# Altium schematic sheet Sheet1.SchDoc
size 431 x 279 mm; SheetNumber: 1; SheetTotal: 1
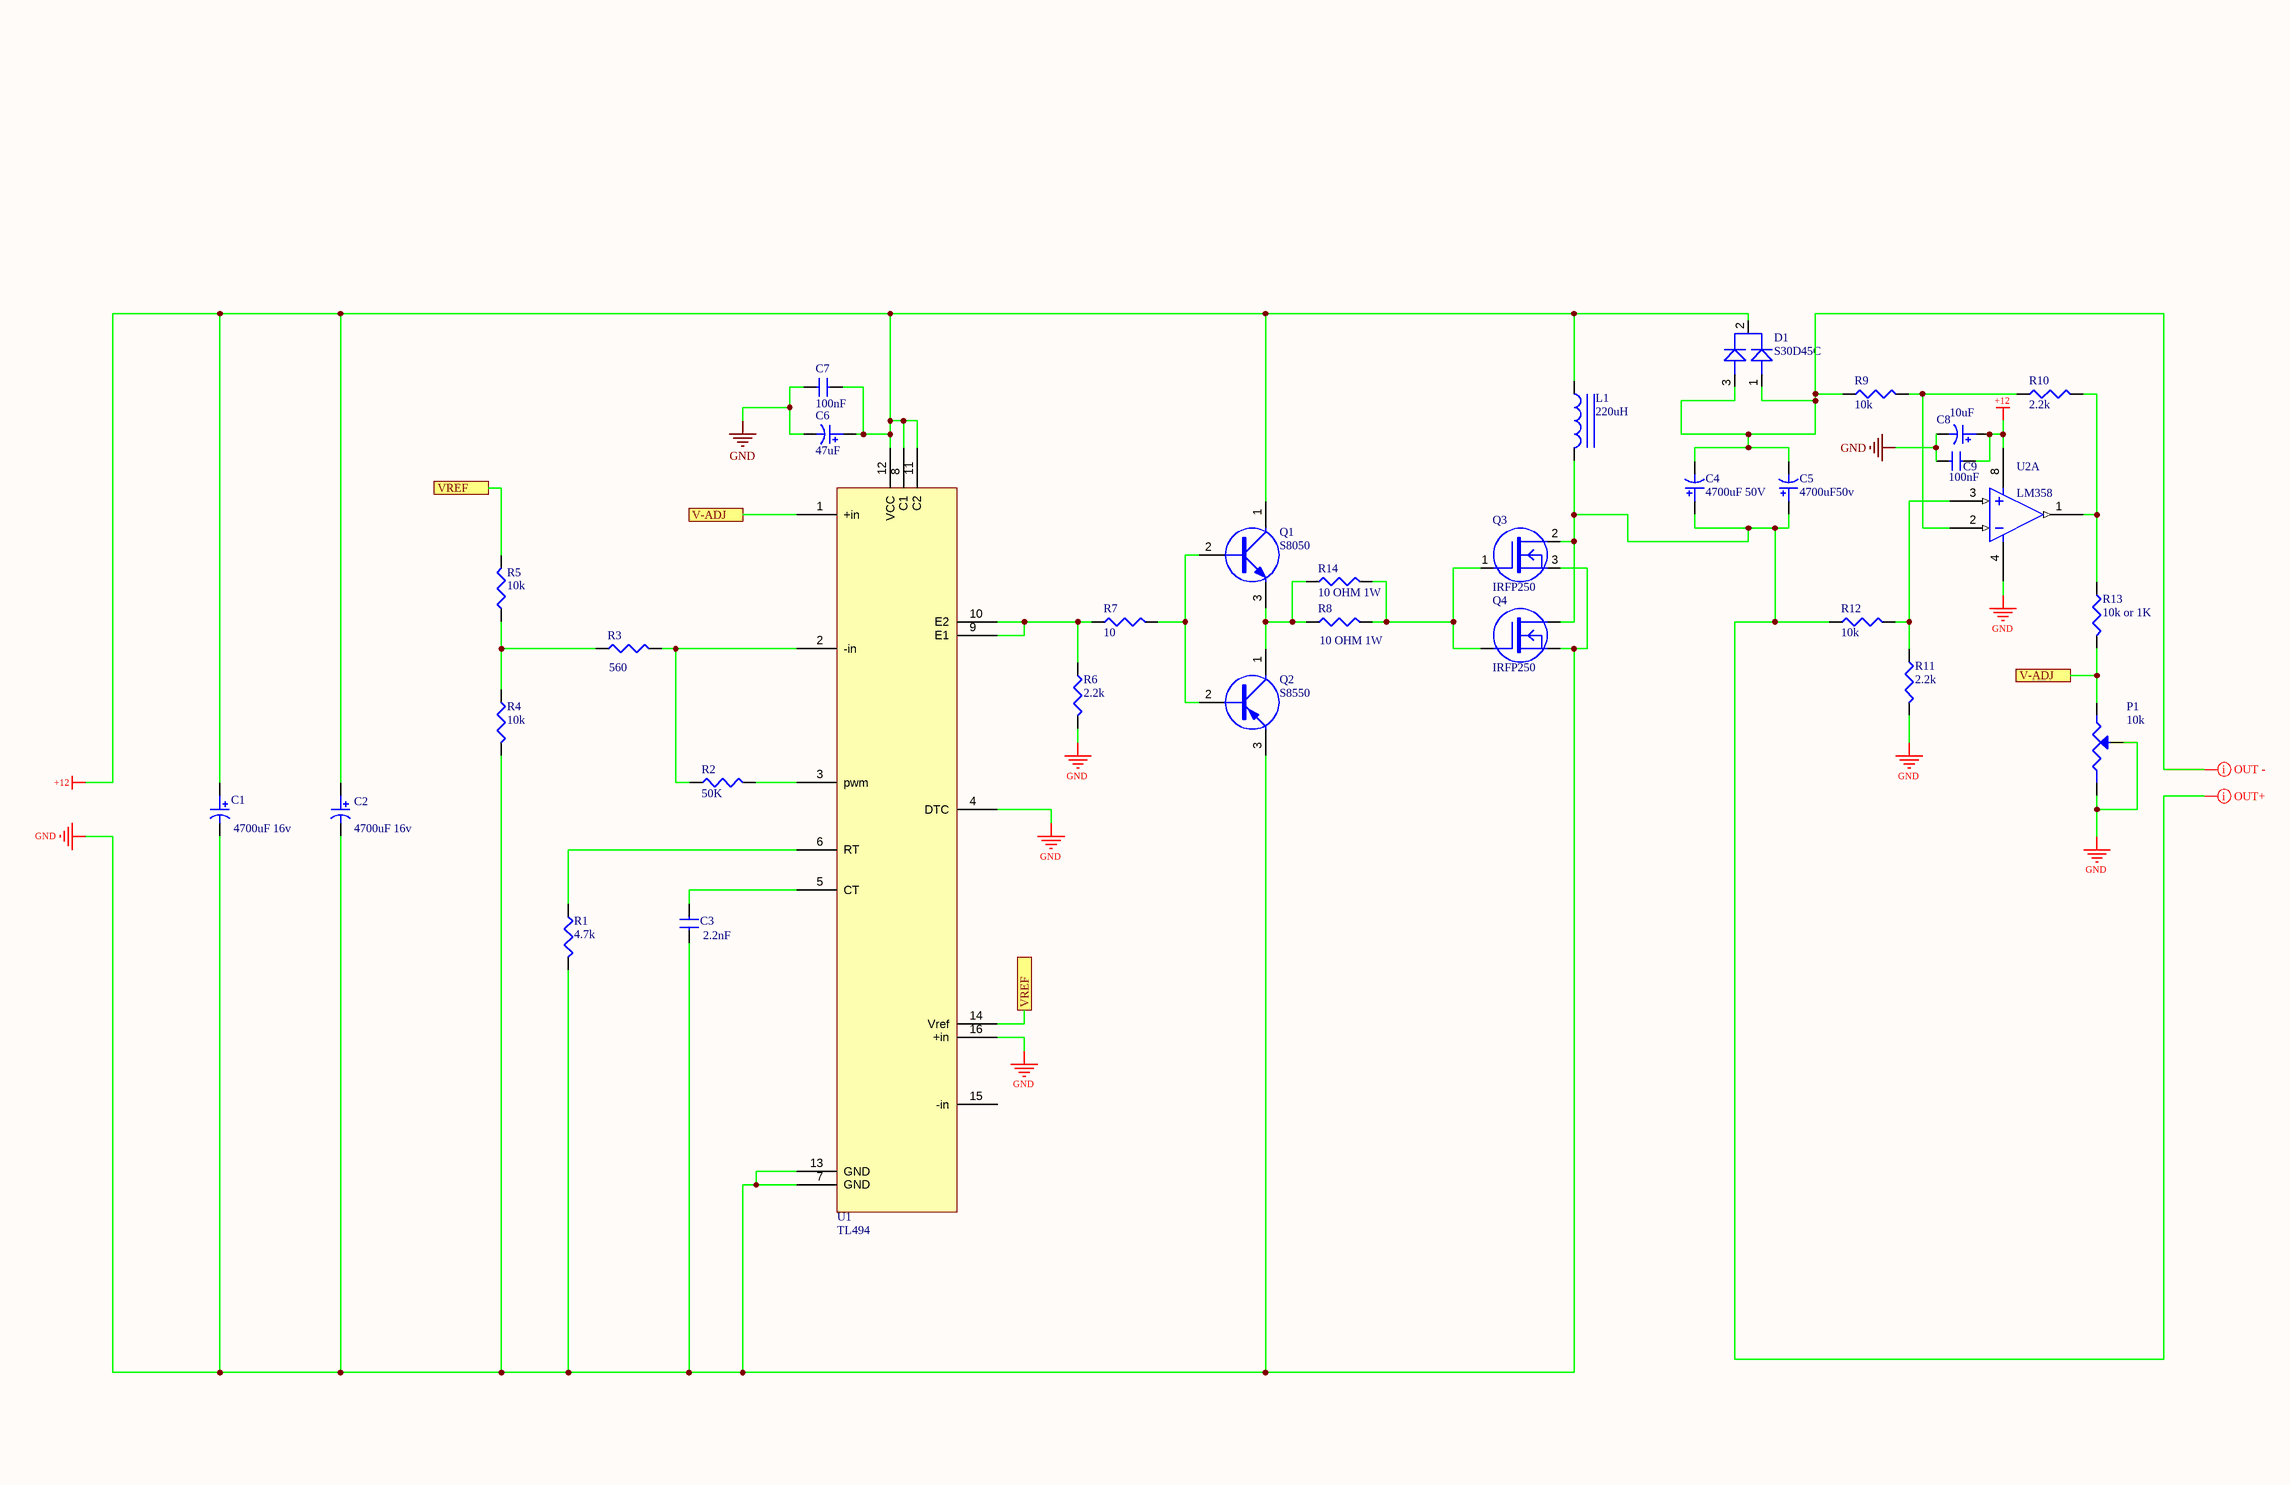
[diagram p0: Sheet1.SchDoc]

## Parts
C1  4700uF 16v  [RB5-10.5]
C2  4700uF 16v  [RB5-10.5]
C3  2.2nF  [CAPR5-4X5]
C4  4700uF 50V  [RB7.6-15]
C5  4700uF50v  [RB7.6-15]
C6  47uF  [CAPR5-4X5]
C7  100nF  [CAPR5-4X5]
C8  10uF  [CAPR5-4X5]
C9  100nF  [CAPR5-4X5]
D1  S30D45C  [TO-247]
L1  220uH  [RB7.6-15]
P1  10k  [VR5]
Q1  S8050  [TO-220-AB]
Q2  S8550  [TO-220-AB]
Q3  IRFP250  [TO-247]
Q4  IRFP250  [TO-247]
R1  4.7k  [AXIAL0.4]
R2  50K  [AXIAL0.4]
R3  560  [AXIAL0.4]
R4  10k  [AXIAL0.4]
R5  10k  [AXIAL0.4]
R6  2.2k  [AXIAL0.4]
R7  10  [AXIAL0.4]
R8  10 OHM 1W  [AXIAL-0.6]
R9  10k  [AXIAL0.4]
R10  2.2k  [AXIAL0.4]
R11  2.2k  [AXIAL0.4]
R12  10k  [AXIAL0.4]
R13  10k or 1K  [AXIAL-0.6]
R14  10 OHM 1W  [AXIAL-0.6]
U1  TL494  [DIP16]
U2  LM358  [DIP8]  (part A of 2)

## Ports
V-ADJ, VREF

## Nets
+12: C1.1 C2.1 C6.1 C7.2 C8.1 C9.2 D1.2 L1.1 Q1.1(C) U1.8(C1) U1.11(C2) U1.12(VCC) U2.8(V-)
GND: C1.2 C2.2 C3.2 C6.2 C7.1 C8.2 C9.1 P1.2 P1.3 Q2.3(E) Q3.3 Q4.3 R1.2 R4.2 R6.2 R11.2 U1.4(DTC) U1.7(GND) U1.13(GND) U1.16(+in) U2.4(V+)
V-ADJ: P1.1 R13.2 U1.1(+in) ; port V-ADJ
VREF: R5.2 U1.14(Vref) ; port VREF
NetC3_1: C3.1 U1.5(CT)
NetC4_1: C4.1 C5.1 L1.2 Q3.2 Q4.2 R12.1
NetC4_2: C4.2 C5.2 D1.1 D1.3 R9.1
NetQ1_2: Q1.2(B) Q2.2(B) R7.2
NetQ1_3: Q1.3(E) Q2.1(C) R8.1 R14.1
NetQ3_1: Q3.1 Q4.1 R8.2 R14.2
NetR1_1: R1.1 U1.6(RT)
NetR2_1: R2.1 R3.2 U1.2(-in)
NetR2_2: R2.2 U1.3(pwm)
NetR3_1: R3.1 R4.1 R5.1
NetR6_1: R6.1 R7.1 U1.9(E1) U1.10(E2)
NetR9_2: R9.2 R10.1 U2.2(-IN)
NetR10_2: R10.2 R13.1 U2.1(OUT)
NetR11_1: R11.1 R12.2 U2.3(+IN)

Not connected (* = marked no-connect by the designer): U1 15(-in)

## Layout directives
mark named OUT+: NetC4_1
mark named OUT -: NetC4_2

## Notes on the sheet
- DWG. NO.
- REV.
- SHT.
- THIS DOCUMENT AND THE DATA DISCLOSED HEREIN OR HEREWITH IS THE PROPERTY OF ALTIUM LIMITED AND MAY BE FREELY DISTRIBUTED IN WHOLE. NO RIGHTS ARE RESERVED OR EXPRESS OR IMPLIED WARANTEE GIVEN.
- REVISION
- DESCRIPTION
- DATE
- APPROVED
- ENG:
- APPROVALS
- PROJECT
- DSN:
- CHK:
- REFERENCE DOCUMENTS
- PROJECT REVISION:
- TITLE
- DOCUMENT REVISION:
- DESIGN ITEM:
- BOM:
- FAB DWG:
- PCB DWG:
- ASSY DWG:
- SCALE:
- SIZE
- B
- CAGE CODE
- FILE NAME
- DWG NO.
- SHEET
- OF
- REV

## Library data of the parts
C1 C2 C4-C6 C8 = CAPACITOR POL
C3 C7 C9 = CAP
D1 = DIODE-DUAL
L1 = INDUCTOR IRON
P1 = RES VAR
Q1 = NPN3
Q2 = PNP3
Q3 Q4 = MOSFET-N1
R1-R14 = RES